# Altium schematic sheet USB to UART.SchDoc
size A; SheetNumber: 6; SheetTotal: 6
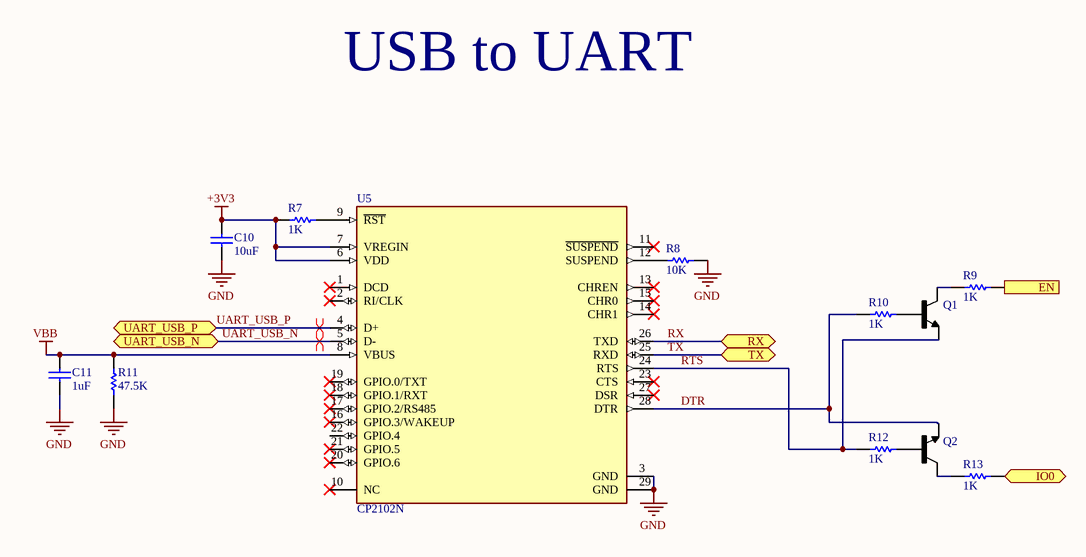
[diagram p0: USB to UART.SchDoc]

## Parts
C10  10uF  [C0402]
C11  1uF  [C0402]
Q1  Transistor  [Transistor]  (value not drawn)
Q2  Transistor  [Transistor]  (value not drawn)
R7  1K  [R0402]
R8  10K  [R0402]
R9  1K  [R0402]
R10  1K  [R0402]
R11  47.5K  [R0402]
R12  1K  [R0402]
R13  1K  [R0402]
U5  CP2102N  [QFN28]

## Ports
EN (out), IO0 (bidir), RX (bidir, see Sheet1[1C], Connectors[4A]), TX (bidir, see Sheet1[1C], Connectors[4A]), UART_USB_N (bidir, see Sheet1[1C], Connectors[1C], Connectors[3C]), UART_USB_P (bidir, see Sheet1[1C], Connectors[1C], Connectors[3C])

## Nets
+3V3: C10.02(-) R7.02 U5.6(VDD) U5.7(VREGIN)
GND: C10.01(+) C11.01(+) R8.01 R11.01 U5.3(GND) U5.29(GND)
VBB: C11.02(-) R11.02 U5.8(VBUS)
DTR: Q2.2(E) R10.02 U5.28(DTR)
EN: R9.01 ; port EN
IO0: R13.01 ; port IO0
RTS: Q1.2(E) R12.02 U5.24(RTS)
RX: U5.26(TXD) ; port RX
TX: U5.25(RXD) ; port TX
UART_USB_N: U5.5(D-) ; port UART_USB_N
UART_USB_P: U5.4(D+) ; port UART_USB_P
NetQ1_1: Q1.1(B) R10.01
NetQ1_3: Q1.3(C) R9.02
NetQ2_1: Q2.1(B) R12.01
NetQ2_3: Q2.3(C) R13.02
NetR7_01: R7.01 U5.9(~{RST})
NetR8_02: R8.02 U5.12(SUSPEND)

Not connected (* = marked no-connect by the designer): U5 1(DCD)* 2(RI/CLK)* 10(NC)* 11(~{SUSPEND})* 13(CHREN)* 14(CHR1)* 15(CHR0)* 16(GPIO.3/WAKEUP)* 17(GPIO.2/RS485)* 18(GPIO.1/RXT)* 19(GPIO.0/TXT)* 20(GPIO.6)* 21(GPIO.5)* 22(GPIO.4) 23(CTS)* 27(DSR)*

## Layout directives
differential pair; differential pair class DIFF90: UART_USB_N, UART_USB_P

## Notes on the sheet
- USB to UART

## Library data of the parts
C10 C11 = Cap
R7-R13 = Res
U5 = CP2102N: USB Bridge, USB to UART USB 2.0 UART Interface 28-QFN (5x5)